# EAGLE design bitlight (EAGLE 7.3.0)
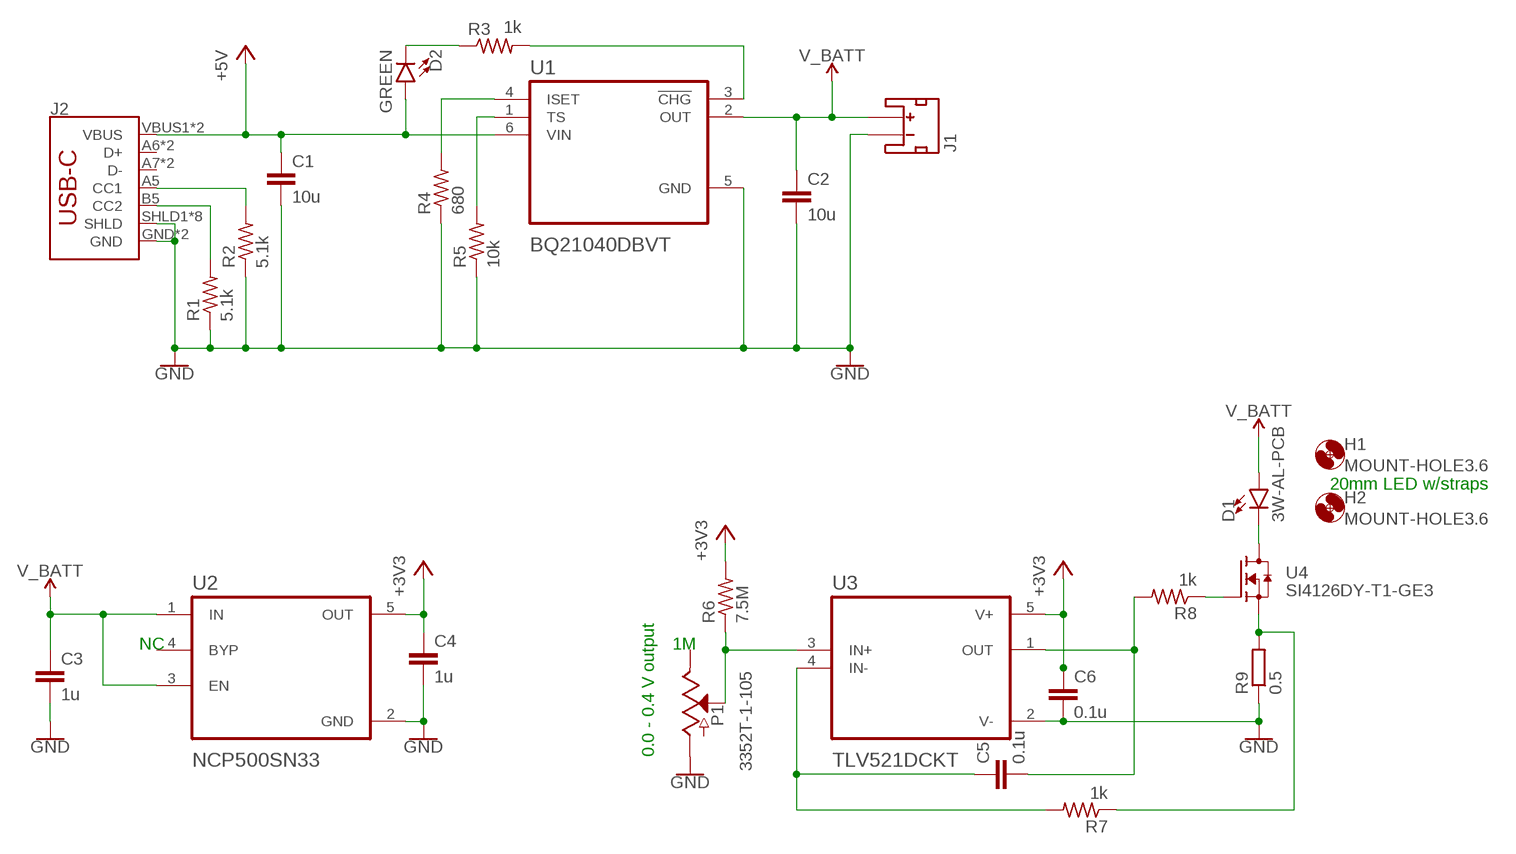
[diagram p0: schematic, sheet 1]

## Parts
C1  10u  C-EUC0603  [C0603]
C2  10u  C-EUC0603  [C0603]
C3  1u  C-EUC0603  [C0603]
C4  1u  C-EUC0603  [C0603]
C5  0.1u  C-EUC0603  [C0603]
C6  0.1u  C-EUC0603  [C0603]
D1  3W-AL-PCB  [AL-PCB-20MM]
D2  GREEN  LED-GREEN0603  [LED-0603]
H1  MOUNT-HOLE3.6  [3,6]
H2  MOUNT-HOLE3.6  [3,6]
J1  JST_2MM_MALE  [JST-2-SMD]
J2  USB_C16PIN  [USB-C-16P]
P1  3352T-1-105  3352T-1  [3352T-1]
R1  5.1k  R-US_R0603  [R0603]
R2  5.1k  R-US_R0603  [R0603]
R3  1k  R-US_R0603  [R0603]
R4  680  R-US_R0603  [R0603]
R5  10k  R-US_R0603  [R0603]
R6  7.5M  R-US_R0603  [R0603]
R7  1k  R-US_R0603  [R0603]
R8  1k  R-US_R0603  [R0603]
R9  0.5  R-EU_R2512  [R2512]
U1  BQ21040DBVT  [SOT95P280X145-6N]
U2  NCP500SN33  MIC5205YM5  [SOT95P280X145-5N]
U3  TLV521DCKT  [SOT65P210X110-5N]
U4  SI4126DY-T1-GE3  [SOIC127P600X175-8N]

## Nets
+3V3: C4.1 C6.1 R6.2 U2.5(OUT) U3.5(V+)
+5V: C1.1 D2.A J2.VBUS1(VBUS) J2.VBUS2(VBUS) U1.6(VIN)
GND: C1.2 C2.2 C3.2 C4.2 C6.2 J1.1(-) J2.GND J2.GND2(GND) J2.SHLD1(SHLD) J2.SHLD2(SHLD) J2.SHLD3(SHLD) J2.SHLD4(SHLD) J2.SHLD5(SHLD) J2.SHLD6(SHLD) J2.SHLD7(SHLD) J2.SHLD8(SHLD) P1.CCW(A) R1.1 R2.1 R4.1 R5.1 R9.1 U1.5(GND) U2.2(GND) U3.2(V-)
N$1: R3.2 U1.3(!CHG)
N$2: C5.1 R7.2 U3.4(IN-)
N$3: D1.-(C) U4.5(D) U4.6(D) U4.7(D) U4.8(D)
N$5: D2.C R3.1
N$7: R7.1 R9.2 U4.1(S) U4.2(S) U4.3(S)
N$8: C5.2 R8.2 U3.1(OUT)
N$9: J2.B5(CC2) R1.2
N$10: R8.1 U4.4(G)
N$12: P1.WIPE(S) R6.1 U3.3(IN+)
N$13: J2.A5(CC1) R2.2
PROG: R4.2 U1.4(ISET)
THERM: R5.2 U1.1(TS)
V_BATT: C2.1 C3.1 D1.+(A) J1.2(+) U1.2(OUT) U2.1(IN) U2.3(EN)
Unconnected: J1.NC1(PAD1) J1.NC2(PAD2) J2.A6(D+) J2.A7(D-) J2.B6(D+) J2.B7(D-) P1.CW(E) U2.4(BYP)

## Notes on the sheet
- 20mm LED w/straps
- NC | 1M
- 0.0 - 0.4 V output

## Library data of the parts
C1-C6 = rcl:C-EU: CAPACITOR, European symbol
D1 = 3W-AL-PCB:3W-AL-PCB
D2 = SparkFun-LED:LED-GREEN: Green SMD LED Used in manufacturing of various products at SparkFun Packages: 0603 - SMD 0603 package [Product Link] <http://www.futureelectronics.com/en/technologies/semiconductors/optoelectronics/leds/Pages/9894312-LTST-C190GKT.aspx?CrossPart=HSMG-C190&IM=0> LilyPad 1206 - SMD1206 LilyPad package [Product Link] <http://www.futureelectronics.com/en/Technologies/Product.aspx?ProductID=IN150NGHARVATEKCORPORATION2049943&IM=0> 1206 - SMD1206 package [Product Link] <http://www.futureelectronics.com/en/technologies/semiconductors/optoelectronics/leds/Pages/8315665-LTST-C150KGKT.aspx?IM=0> 1206 Bottom Mount -SMD 1206 Bottom Mount [Product Link] <http://www.digikey.com/product-detail/en/lite-on-inc/LTST-C230KGKT/160-1456-1-ND/386854> SparkFun Products: Pro Mini 328 -5V <https://www.sparkfun.com/products/821> RedBoard <https://www.sparkfun.com/products/12757> MP3 Trigger <https://www.sparkfun.com/products/13720> Makey Makey <https://www.sparkfun.com/products/11076>; PROD_ID: DIO-00821
H1 H2 = holes:MOUNT-HOLE: MOUNTING HOLE with drill center marker
J1 = SparkFun-Connectors:JST_2MM_MALE: JST 2MM MALE RA CONNECTOR Two pin, compact surface mount connector. Commonly used as a battery input connection point. We really like the solid locking feeling and high current rating on these small connectors. We use these all the time as battery connectors. Mates to single-cell LiPo batteries. Here is the connector we sell at SparkFun: JST Right Angle Connector - White <https://www.sparkfun.com/products/8612> (PRT-08612) Datasheet <http://www.sparkfun.com/datasheets/Prototyping/Connectors/JST-Horizontal.pdf> It was used on these SparkFun products: SparkFun MOSFET Power Controller <https://www.sparkfun.com/products/11214> (PRT-11214) SparkFun Battery Babysitter - LiPo Battery Manager <https://www.sparkfun.com/products/13777> (PRT-13777) And many, many others that required a lipo battery connection.; PROD_ID: CONN-11443; SF_ID: PRT-08612
J2 = SparkFun-Connectors:USB_C: USB Type C 16Pin Connector Super Speed pins not available on the 16-pin purely SMD connector so this part is best for USB 2.0 implementations. D1 and D2 are tied together enabling D+/- no matter which way the cable is plugged into the connector. The two channel configuration pins (CC1/2) are exposed. These are normally connected to ground via 5.1k resistors but can be reconfigured for high current/high power applications.; PROD_ID: CONN-14122
P1 = 3352T-1:3352T-1
R1-R8 = rcl:R-US_: RESISTOR, American symbol
R9 = rcl:R-EU_: RESISTOR, European symbol
U1 = BQ21040DBVT:BQ21040DBVT: Check prices <https://pricing.snapeda.com/parts/BQ21040DBVT/Texas%20Instruments/view-part?ref=eda>; AVAILABILITY: Bad; DESCRIPTION: 1-cell, 0.8-A Li-ion and Li-polymerymer battery charger 6-SOT-23 0 to 125; MF: Texas Instruments; MP: BQ21040DBVT; PACKAGE: SOT-23-6 Texas Instruments; PRICE: None; PURCHASE-URL: https://pricing.snapeda.com/search/part/BQ21040DBVT/?ref=eda
U2 = MIC5205YM5:MIC5205YM5: None Check prices <https://pricing.snapeda.com/parts/MIC5205YM5/Micrel/view-part?ref=eda>; AVAILABILITY: Warning; DESCRIPTION: Ic Reg Ldo 150ma Adj 1% Sot23-5 - Mic5205ym5 Tr; MF: Micrel; MP: MIC5205YM5; PACKAGE: SOT-23 Microchip; PRICE: None; PURCHASE-URL: https://pricing.snapeda.com/search/part/MIC5205YM5/?ref=eda
U3 = TLV521DCKT:TLV521DCKT: Check prices <https://pricing.snapeda.com/parts/TLV521DCKT/Texas%20Instruments/view-part?ref=eda>; AVAILABILITY: Warning; DESCRIPTION: 350-nA Nanopower, Single, RRIO, CMOS Input, Operational Amplifier for Cost-Sensitive Systems 5-SC70 -40 to 125; MF: Texas Instruments; MP: TLV521DCKT; PACKAGE: SOT-SC70-5 Texas Instruments; PRICE: None; PURCHASE-URL: https://pricing.snapeda.com/search/part/TLV521DCKT/?ref=eda
U4 = SI4126DY-T1-GE3:SI4126DY-T1-GE3: Single N-Channel 30 V 0.00275 Ohm Surface Mount Power Mosfet - SOIC-8 Check prices <https://pricing.snapeda.com/parts/SI4126DY-T1-GE3/Vishay%20Siliconix/view-part?ref=eda>; AVAILABILITY: Good; DESCRIPTION: N-Channel 30V 39A (Tc) 3.5W (Ta), 7.8W (Tc) Surface Mount 8-SO; MF: Vishay Siliconix; MP: SI4126DY-T1-GE3; PACKAGE: SOIC-8 Vishay; PRICE: None; PURCHASE-URL: https://pricing.snapeda.com/search/part/SI4126DY-T1-GE3/?ref=eda

## Board
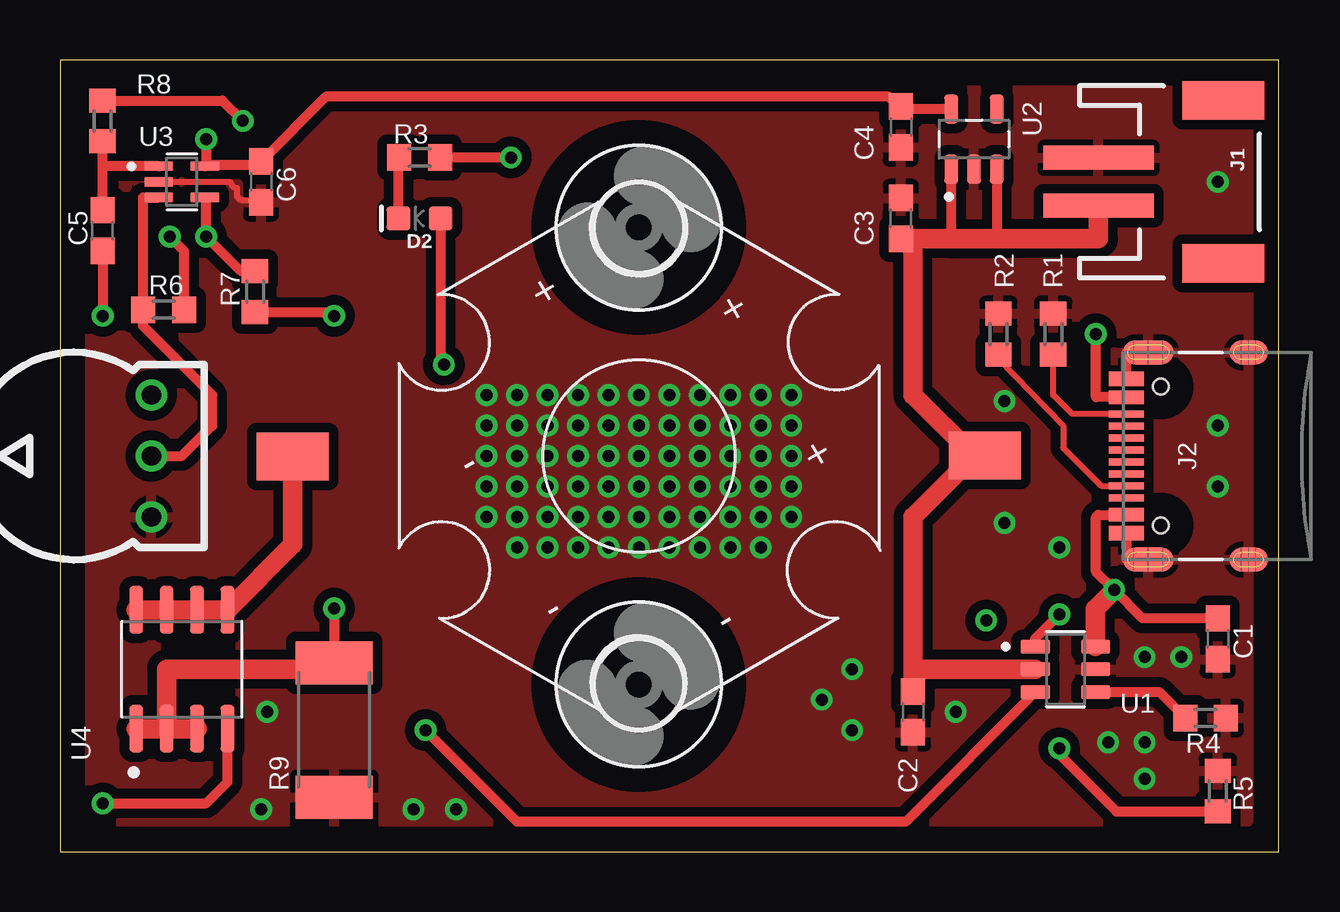
[diagram p1: board, top side]
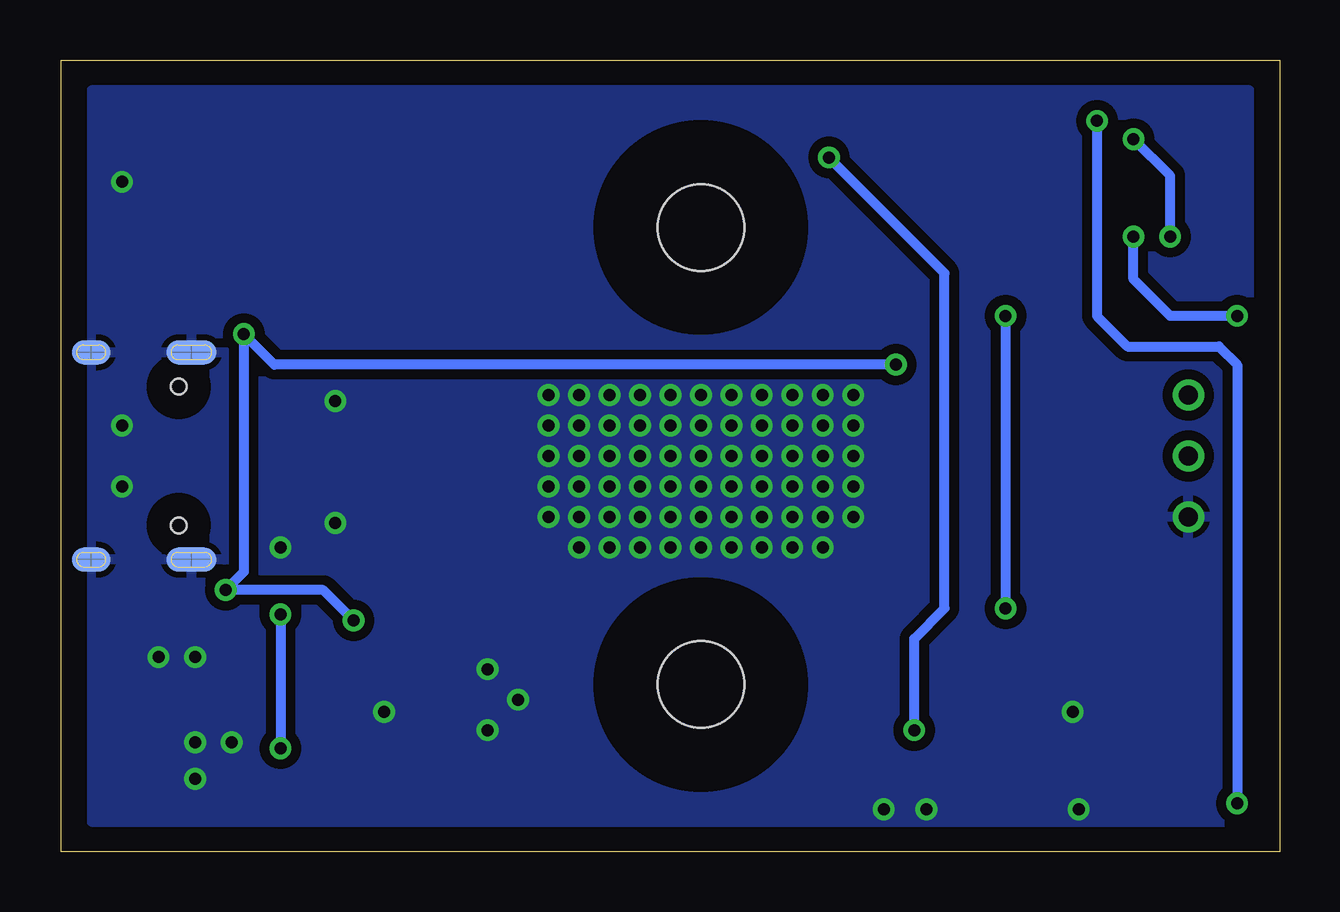
[diagram p2: board, bottom side, seen from below]

Size 50.8 x 33.02 mm. Coordinates in mm from the lower left corner, seen from the top.
Outline: 0,0 50.8,0 50.8,33.02 0,33.02 0,0
Copper layers (1*16): Top 0.035mm / dielectric 1.5mm / Bottom 0.035mm
Design rules "default *": minimum track width 8mil, minimum drill 8mil, track to track 8mil, track to pad 8mil, pad to pad 8mil, via to via 8mil, smd to smd 8mil, copper to edge 40mil, drill to drill 8mil, minimum pad ring 10mil, minimum via ring 8mil, stop-mask expansion 4mil, vias tented up to drill 0mil, thermal gap 10mil

### Footprints (pad centres in the part's own frame; a part is rotated, then mirrored left to right if it is on the bottom)
C0603 = smd 1.1 x 1: 1 -0.85,0; 2 0.85,0
AL-PCB-20MM = smd 2 x 3 rotated 60: + -12.5,7.2; - 12.5,-7.2
LED-0603 = smd 1 x 1: A -0.877,0; C 0.877,0
3,6 = hole 3.6: 0,0
JST-2-SMD = smd 1 x 4.6: 1 -1,-3.7; 2 1,-3.7 | smd 1.6 x 3.4: NC1 -3.4,1.5; NC2 3.4,1.5
USB-C-16P = smd 0.3 x 1.45: A5 -1.25,0; A6 -0.25,0; A7 0.25,0; A8 1.25,0; B5 1.75,0; B6 0.75,0; B7 -0.75,0; B8 -1.75,0 | smd 0.6 x 1.45: GND -3.225,0; GND2 3.225,0 | smd 1 x 2.1: SHLD1 -4.32,-0.915; SHLD2 4.32,-0.915 | smd 1 x 2.1 bottom: SHLD3 -4.32,-0.915; SHLD4 4.32,-0.915 | smd 1 x 1.6: SHLD5 -4.32,-5.095; SHLD8 4.32,-5.095 | smd 1 x 1.6 bottom: SHLD6 -4.32,-5.095; SHLD7 4.32,-5.095 | smd 0.55 x 1.45: VBUS1 -2.45,0; VBUS2 2.45,0 | hole 0.65: -2.89,-1.445; 2.89,-1.445
3352T-1 = drill 0.8: CCW -2.54,0; CW 2.54,0; WIPE 0,0
R0603 = smd 1 x 1.1: 1 -0.85,0; 2 0.85,0
R2512 = smd 1.8 x 3.2: 1 -2.8,0; 2 2.8,0
SOT95P280X145-6N = smd 1.21 x 0.58: 1 -1.255,0.95; 2 -1.255,0; 3 -1.255,-0.95; 4 1.255,-0.95; 5 1.255,0; 6 1.255,0.95
SOT95P280X145-5N = smd 1.21 x 0.59: 1 -1.255,0.95; 2 -1.255,0; 3 -1.255,-0.95; 4 1.255,-0.95; 5 1.255,0.95
SOT65P210X110-5N = smd 1.19 x 0.4: 1 -0.96,0.65; 2 -0.96,0; 3 -0.96,-0.65; 4 0.96,-0.65; 5 0.96,0.65
SOIC127P600X175-8N = smd 1.97 x 0.57: 1 -2.475,1.905; 2 -2.475,0.635; 3 -2.475,-0.635; 4 -2.475,-1.905; 5 2.475,-1.905; 6 2.475,-0.635; 7 2.475,0.635; 8 2.475,1.905

### Placement (x,y rotation side)
C1  48.26,8.89 270 top
C2  35.56,5.84 270 top
C3  35.05,26.42 90 top
C4  35.05,30.23 270 top
C5  1.78,25.91 90 top
C6  8.38,27.94 270 top
D1  24.13,16.51 210 top
D2  14.99,26.42 180 top
H1  24.13,6.99 0 top
H2  24.13,26.04 0 top
J1  46.99,27.94 270 top
J2  44.45,16.51 90 top
P1  3.81,16.51 90 top
R1  41.4,21.59 270 top
R2  39.12,21.59 270 top
R3  14.99,28.96 0 top
R4  47.75,5.59 180 top
R5  48.26,2.54 270 top
R6  4.32,22.61 0 top
R7  8.13,23.37 90 top
R8  1.78,30.48 270 top
R9  11.43,5.08 90 top
U1  41.91,7.62 0 top
U2  38.1,29.72 90 top
U3  5.08,27.94 0 top
U4  5.08,7.62 90 top

### Tracks (layer width: path | path; a pad name or v marks a point on that pad's centre or on a via)
+3V3  (via drill 0.5)
  Top 0.406: U2.5 35.05,30.97 | 35.05,30.97 C4.1 | R6.2 5.17,25.06 v4.57,25.65 | v6.1,29.72 6.1,28.65 | 6.1,28.65 U3.5 | 6.1,28.65 8.24,28.65 C6.1 11.07,31.48 34.56,31.48 34.8,31.24 35.05,30.97
  Bottom 0.406: v4.57,25.65 4.57,28.19 v6.1,29.72
+5V  (via drill 0.5)
  Top 0.406: J2.VBUS2 43.18,18.96 v43.18,21.59 | J2.VBUS1 43.27,14.06 43.18,13.97 43.18,11.68 v43.94,10.92 45.12,9.74 C1.1 | D2.A 15.86,20.46 v16,20.32
  Top 0.813: U1.6 43.16,10.14 v43.94,10.92
  Bottom 0.406: v38.61,9.65 39.88,10.92 v43.94,10.92 43.18,11.68 v43.18,21.59 41.91,20.32 v16,20.32
GND  (via drill 0.5)
  Top 0.254: U3.2 7.11,27.94 arc90 7.37,27.69 7.37,27.43 arc90 7.62,27.18 8.29,27.18 arc-90 C6.2
  Top 0.406: J2.GND2 44.45,20.83 J2.SHLD4 | J2.GND 44.45,12.19 J2.SHLD3
  other vias: 17.78,17.78 20.32,15.24 22.86,12.7 25.4,15.24 22.86,17.78 27.94,17.78 27.94,12.7 39.37,18.8 41.66,12.7 48.26,17.78 48.26,15.24 48.26,27.94 43.69,4.57 45.21,4.57 45.21,3.05 45.21,8.13 46.74,8.13 14.73,1.78 16.51,1.78 8.38,1.78 8.64,5.84 33.02,5.08 33.02,7.62 31.75,6.35 37.34,5.84 39.37,13.72 17.78,16.51 17.78,15.24 19.05,15.24 19.05,16.51 19.05,17.78 20.32,17.78 20.32,16.51 21.59,17.78 21.59,16.51 22.86,16.51 22.86,15.24 21.59,15.24 24.13,15.24 24.13,16.51 24.13,17.78 25.4,17.78 25.4,16.51 26.67,17.78 26.67,16.51 26.67,15.24 27.94,15.24 27.94,16.51 29.21,16.51 29.21,17.78 30.48,17.78 30.48,16.51 30.48,15.24 30.48,13.97 29.21,13.97 29.21,15.24 27.94,13.97 26.67,13.97 25.4,13.97 24.13,13.97 22.86,13.97 21.59,13.97 20.32,13.97 19.05,13.97 17.78,13.97 17.78,19.05 19.05,19.05 20.32,19.05 21.59,19.05 22.86,19.05 24.13,19.05 25.4,19.05 26.67,19.05 27.94,19.05 29.21,19.05 30.48,19.05 29.21,12.7 26.67,12.7 25.4,12.7 24.13,12.7 21.59,12.7 20.32,12.7 19.05,12.7
  pour Bottom (isolate 0.406): 1.27,31.75 49.53,31.75 49.53,1.27 1.27,1.27
  pour Top (isolate 0.406): 1.27,31.75 49.53,31.75 49.53,1.27 1.27,1.27
N$1  (via drill 0.5)
  Top 0.406: U1.3 35.26,1.27 19.05,1.27 v15.24,5.08 | v18.8,28.96 R3.2
  Bottom 0.406: v15.24,5.08 15.24,8.89 13.97,10.16 13.97,24.13 v18.8,28.96
N$2  (via drill 0.5)
  Top 0.406: C5.1 v1.78,22.35 | U3.4 6.1,27.23 v6.1,25.65 7.53,24.22 R7.2
  Bottom 0.406: v1.78,22.35 4.57,22.35 6.1,23.88 v6.1,25.65
N$3
  Top 0.813: U4.8 U4.7 U4.6 U4.5 9.71,12.81 D1.-
N$5
  Top 0.406: D2.C 14.11,28.93 R3.1
N$7  (via drill 0.5)
  Top 0.406: R7.1 11.43,22.52 v11.43,22.35 | v11.43,10.16 R9.2
  Top 0.813: U4.1 U4.2 | U4.2 U4.3 | R9.2 11.17,7.62 4.45,7.62 U4.2
  Bottom 0.406: v11.43,22.35 v11.43,10.16
N$8
  Top 0.406: U3.1 1.78,28.59 | 1.78,28.59 R8.2 | C5.2 1.78,28.59
N$9
  Top 0.254: J2.B5 42.19,18.26 41.4,19.05 R1.2
N$10  (via drill 0.5)
  Top 0.406: R8.1 6.77,31.33 v7.62,30.48 | v1.78,2.03 6.1,2.03 6.99,2.92 U4.4
  Bottom 0.406: v1.78,2.03 1.78,20.32 2.54,21.08 6.35,21.08 7.62,22.35 v7.62,30.48
N$12
  Top 0.406: U3.3 3.47,27.29 R6.1 3.47,21.93 6.35,19.05 6.35,17.78 5.08,16.51 P1.WIPE
N$13
  Top 0.254: R2.2 39.12,20.57 41.82,17.78 41.82,16.85 43.41,15.26 J2.A5
PROG
  Top 0.406: U1.4 45.82,6.67 R4.2
THERM  (via drill 0.5)
  Top 0.406: U1.1 40.66,8.9 v41.66,9.91 | v41.66,4.32 41.66,4.06 44.03,1.69 R5.2
  Bottom 0.406: v41.66,9.91 v41.66,4.32
V_BATT
  Top 0.406: U2.1 37.15,25.57 35.56,25.57 C3.1 | U2.3 39.05,25.57
  Top 0.813: 37.15,25.57 39.05,25.57 43.29,25.57 J1.2 | 37.66,25.57 35.56,25.57 35.56,19.05 38.09,16.52 D1.+ 38.1,16.07 37.66,16.07 35.56,13.97 35.56,7.62 | 35.56,7.62 C2.1 | U1.2 35.56,7.62